# EAGLE design BMCOP (EAGLE 9.6.2)
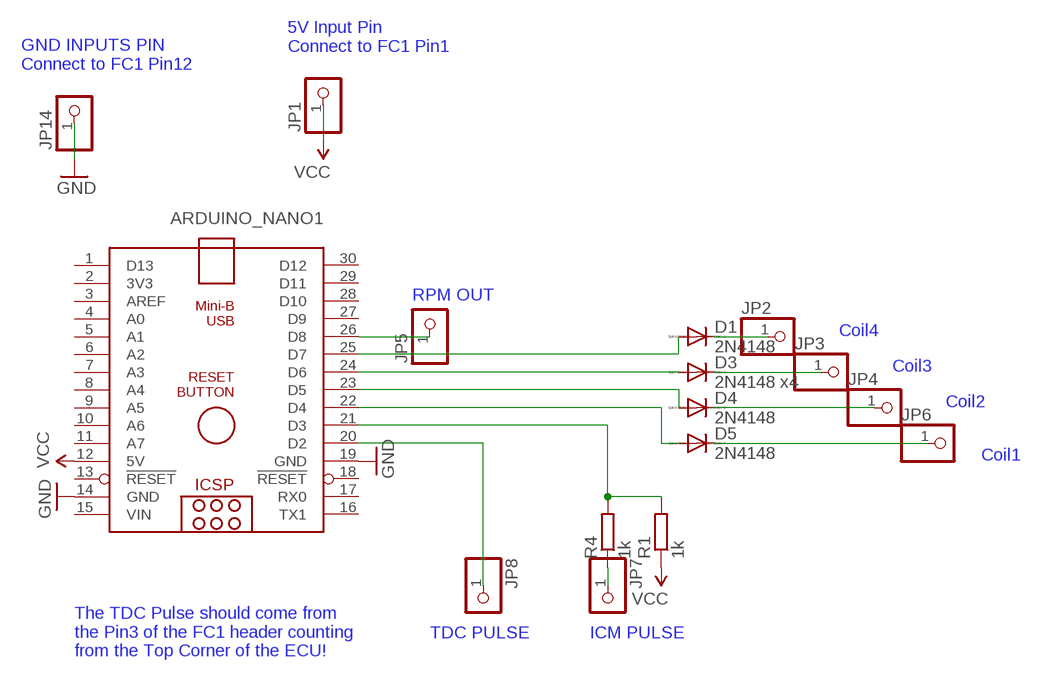
[diagram p0: schematic, sheet 1]

## Parts
ARDUINO_NANO1  ARDUINO_NANO  [ARDUINO_NANO]
D1  2N4148  DIODE-D-7.5  [D-7.5]
D3  2N4148 x4  DIODE-D-7.5  [D-7.5]
D4  2N4148  DIODE-D-7.5  [D-7.5]
D5  2N4148  DIODE-D-7.5  [D-7.5]
JP1  PINHD-1X1  [1X01]
JP2  PINHD-1X1  [1X01]
JP3  PINHD-1X1  [1X01]
JP4  PINHD-1X1  [1X01]
JP5  PINHD-1X1  [1X01]
JP6  PINHD-1X1  [1X01]
JP7  PINHD-1X1  [1X01]
JP8  PINHD-1X1  [1X01]
JP14  PINHD-1X1  [1X01]
R1  1k  R-EU_0204/7  [0204/7]
R4  1k  R-EU_0204/7  [0204/7]

## Nets
GND: ARDUINO_NANO1.14(GND) ARDUINO_NANO1.19(GND) JP14.1
N$1: ARDUINO_NANO1.25(D7) D1.A
N$2: ARDUINO_NANO1.24(D6) D3.A
N$3: ARDUINO_NANO1.23(D5) D4.A
N$4: ARDUINO_NANO1.22(D4) D5.A
N$8: ARDUINO_NANO1.26(D8) JP5.1
N$10: JP7.1 R4.1
N$11: ARDUINO_NANO1.21(D3) R1.2 R4.2
N$21: D4.C JP4.1
N$25: D1.C JP2.1
N$26: D3.C JP3.1
N$29: ARDUINO_NANO1.20(D2) JP8.1
N$31: D5.C JP6.1
VCC: ARDUINO_NANO1.12(5V) JP1.1 R1.1
Unconnected: ARDUINO_NANO1.1(D13) ARDUINO_NANO1.2(3V3) ARDUINO_NANO1.3(AREF) ARDUINO_NANO1.4(A0) ARDUINO_NANO1.5(A1) ARDUINO_NANO1.6(A2) ARDUINO_NANO1.7(A3) ARDUINO_NANO1.8(A4) ARDUINO_NANO1.9(A5) ARDUINO_NANO1.10(A6) ARDUINO_NANO1.11(A7) ARDUINO_NANO1.13(!RESET) ARDUINO_NANO1.16(TX1) ARDUINO_NANO1.17(RX0) ARDUINO_NANO1.18(!RESET) ARDUINO_NANO1.27(D9) ARDUINO_NANO1.28(D10) ARDUINO_NANO1.29(D11) ARDUINO_NANO1.30(D12)

## Notes on the sheet
- 5V Input Pin
  Connect to FC1 Pin1
- GND INPUTS PIN
  Connect to FC1 Pin12
- RPM OUT
- Coil4
- Coil3
- Coil2
- Coil1
- TDC PULSE | ICM PULSE
- The TDC Pulse should come from
  the Pin3 of the FC1 header counting
  from the Top Corner of the ECU!

## Power pins joined to a net without a drawn wire
VIN: ARDUINO_NANO1.15(VIN)

## Library data of the parts
ARDUINO_NANO1 = ArduinoNanoV30:ARDUINO_NANO: Arduino Nano V3.0 Overview: The Arduino Nano is a small, complete, and breadboard-friendly board based on the ATmega328 (Arduino Nano 3.x) or ATmega168 (Arduino Nano 2.x). It has more or less the same functionality of the Arduino Duemilanove, but in a different package. It lacks only a DC power jack, and works with a Mini-B USB cable instead of a standard one. The Nano was designed and is being produced by Gravitech. Specifications: Microcontroller Atmel ATmega168 or ATmega328 Operating Voltage (logic level) 5 V Input Voltage (recommended) 7-12 V Input Voltage (limits) 6-20 V Digital I/O Pins 14 (of which 6 provide PWM output) Analog Input Pins 8 DC Current per I/O Pin 40 mA Flash Memory 16 KB (ATmega168) or 32 KB (ATmega328) of which 2 KB used by bootloader SRAM 1 KB (ATmega168) or 2 KB (ATmega328) EEPROM 512 bytes (ATmega168) or 1 KB (ATmega328) Clock Speed 16 MHz Dimensions 0.73" x 1.70" Length 45 mm Width 18 mm Weigth 5 g Power: The Arduino Nano can be powered via the Mini-B USB connection, 6-20V unregulated external power supply (pin 30), or 5V regulated external power supply (pin 27). The power source is automatically selected to the highest voltage source. Memory: The ATmega168 has 16 KB of flash memory for storing code (of which 2 KB is used for the bootloader); the ATmega328 has 32 KB, (also with 2 KB used for the bootloader). The ATmega168 has 1 KB of SRAM and 512 bytes of EEPROM (which can be read and written with the EEPROM library); the ATmega328 has 2 KB of SRAM and 1 KB of EEPROM. Input and Output: Each of the 14 digital pins on the Nano can be used as an input or output, using pinMode(), digitalWrite(), and digitalRead() functions. They operate at 5 volts. Each pin can provide or receive a maximum of 40 mA and has an internal pull-up resistor (disconnected by default) of 20-50 kOhms. In addition, some pins have specialized functions. Visit Arduino - ArduinoBoardNano <https://www.arduino.cc/en/Main/ArduinoBoardNano>
D1 D3-D5 = diode:DIODE-: DIODE
JP1-JP8 JP14 = pinhead_MOD:PINHD-1X1: PIN HEADER
R1 R4 = resistor:R-EU_: RESISTOR, European symbol

## Net classes
3 usbvcc: width 0.508 mm, drill 0.61 mm, clearance 0.254 mm

## Board
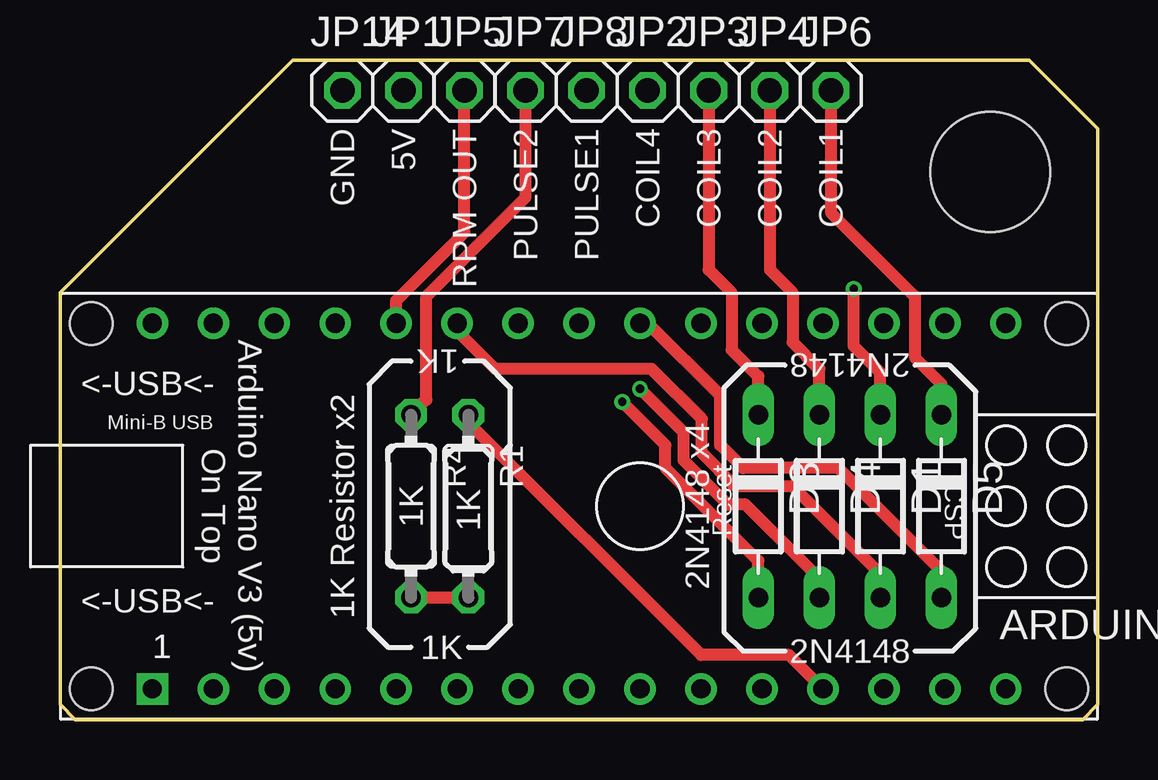
[diagram p1: board, top side]
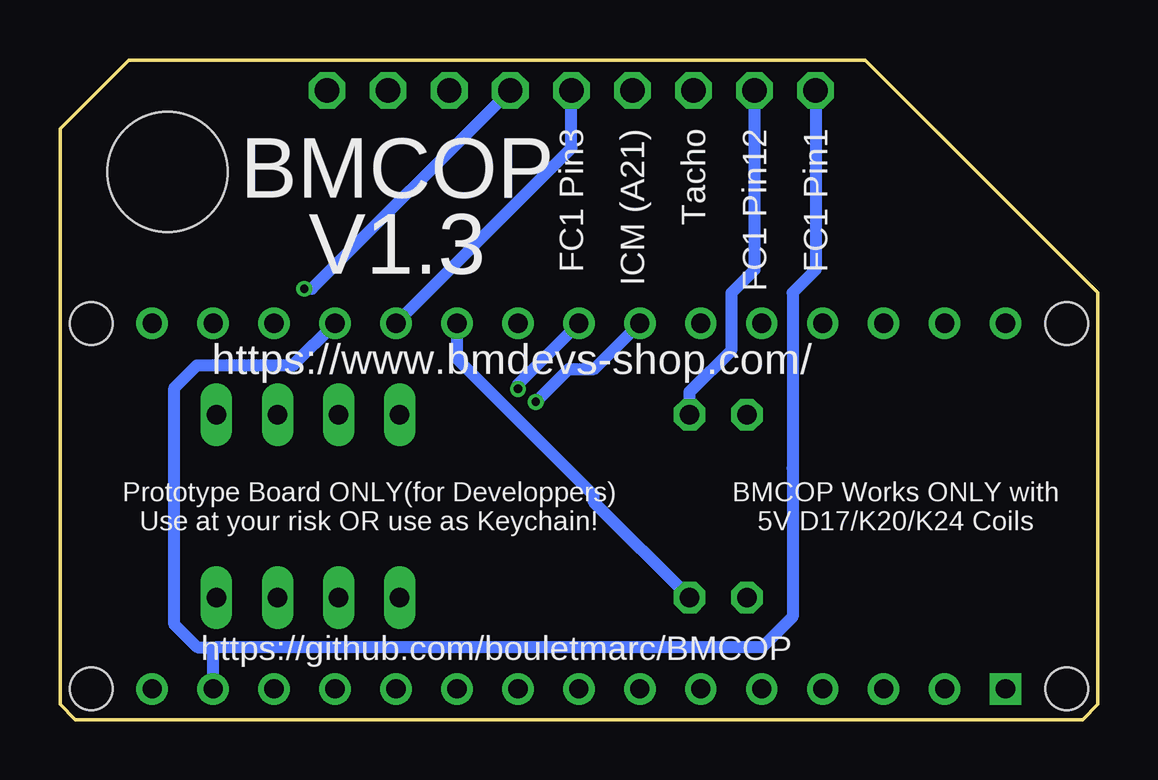
[diagram p2: board, bottom side, seen from below]

Size 43.25 x 27.51 mm. Coordinates in mm from the lower left corner, seen from the top.
Outline: 43.25,0.64 43.25,24.64 40.39,27.51 9.7,27.51 0,17.81 0,0.64 0.64,0 42.61,0 43.25,0.64
Copper layers (1*16): Top 0.035mm / dielectric 1.5mm / Bottom 0.035mm
Design rules "BMBurner_Rules *": minimum track width 10mil, minimum drill 12mil, track to track 10mil, track to pad 10mil, pad to pad 10mil, via to via 10mil, smd to smd 0mil, copper to edge 10mil, drill to drill 10mil, minimum pad ring 10mil, minimum via ring 6mil, stop-mask expansion 2mil, vias tented up to drill 25mil, thermal gap 10mil
Holes 5 mm at 38.76,22.84
tRestrict: area 36.8,20.9 to 40.8,24.9
bRestrict: area 36.8,20.9 to 40.8,24.9

### Footprints (pad centres in the part's own frame; a part is rotated, then mirrored left to right if it is on the bottom)
ARDUINO_NANO = drill 0.8 square: 1 -20.32,-7.62 | drill 0.8: 2 -17.78,-7.62; 3 -15.24,-7.62; 4 -12.7,-7.62; 5 -10.16,-7.62; 6 -7.62,-7.62; 7 -5.08,-7.62; 8 -2.54,-7.62; 9 0,-7.62; 10 2.54,-7.62; 11 5.08,-7.62; 12 7.62,-7.62; 13 10.16,-7.62; 14 12.7,-7.62; 15 15.24,-7.62; 16 15.24,7.62; 17 12.7,7.62; 18 10.16,7.62; 19 7.62,7.62; 20 5.08,7.62; 21 2.54,7.62; 22 0,7.62; 23 -2.54,7.62; 24 -5.08,7.62; 25 -7.62,7.62; 26 -10.16,7.62; 27 -12.7,7.62; 28 -15.24,7.62; 29 -17.78,7.62; 30 -20.32,7.62 | hole 1.778: -22.86,-7.62; -22.86,7.62; 17.78,7.62; 17.78,-7.62
D-7.5 = drill 0.813 long: A 3.81,0; C -3.81,0
1X01 = drill 1.016 octagon: 1 0,0
0204/7 = drill 0.813 octagon: 1 -3.81,0; 2 3.81,0

### Placement (x,y rotation side)
ARDUINO_NANO1  24.17,8.9 0 top
D1  34.19,8.9 270 top
D3  29.1,8.9 270 top
D4  31.64,8.9 270 top
D5  36.73,8.9 270 top
JP1  14.31,26.23 0 top
JP2  24.49,26.23 0 top
JP3  27.03,26.23 0 top
JP4  29.57,26.23 0 top
JP5  16.85,26.23 0 top
JP6  32.12,26.23 0 top
JP7  19.4,26.23 0 top
JP8  21.94,26.23 0 top
JP14  11.77,26.23 0 top
R1  17.01,8.9 270 top
R4  14.63,8.9 270 top

### Tracks (layer width: path | path; a pad name or v marks a point on that pad's centre or on a via)
GND
  Bottom 0.508: JP14.1 11.77,18.76 12.72,17.81 12.72,10.49 12.72,4.29 13.99,3.02 36.73,3.02 | 36.73,3.02 37.52,3.02 38.48,3.98 38.48,13.83 37.52,14.79 33.52,14.79 ARDUINO_NANO1.19 | ARDUINO_NANO1.14 36.87,2.88 36.73,3.02
N$1
  Top 0.508: ARDUINO_NANO1.25 16.55,16.21 18.13,14.63 24.64,14.63 26.75,12.53 26.75,11.13 28.14,9.73 30.53,9.73 34.19,6.08 D1.A
N$2  (via drill 0.35)
  Top 0.508: D3.A 29.1,6.62 25.22,10.5 25.22,11.45 v23.43,13.25
  Bottom 0.508: v23.43,13.25 22.05,14.63 20.98,14.63 ARDUINO_NANO1.24
N$3  (via drill 0.35)
  Top 0.508: D4.A 31.64,5.88 28.55,8.97 27.83,8.97 25.98,10.82 25.98,11.98 v24.17,13.79
  Bottom 0.508: v24.17,13.79 24.17,13.98 ARDUINO_NANO1.23
N$4
  Top 0.508: ARDUINO_NANO1.22 24.5,16.52 27.51,13.52 27.51,11.45 28.46,10.49 32.44,10.49 36.73,6.2 D5.A
N$8
  Top 0.508: ARDUINO_NANO1.26 14.01,17.47 16.85,20.32 JP5.1
N$10
  Top 0.508: R4.1 15.26,13.35 15.26,17.65 19.4,21.78 JP7.1
N$11
  Top 0.508: R4.2 R1.2
  Bottom 0.508: ARDUINO_NANO1.21 26.71,15.06 21.02,9.38 21.02,9.1 R1.2
N$21
  Top 0.508: D4.C 31.64,14.63 30.53,15.74 30.53,17.81 29.57,18.76 JP4.1
N$25  (via drill 0.35)
  Top 0.508: D1.C 34.19,14.47 33.07,15.58 v33.07,17.97
  Bottom 0.508: v33.07,17.97 32.75,17.97 JP2.1
N$26
  Top 0.508: D3.C 29.1,14.31 27.98,15.42 27.98,17.81 27.03,18.76 JP3.1
N$29
  Bottom 0.508: ARDUINO_NANO1.20 21.94,23.83 JP8.1
N$31
  Top 0.508: D5.C 36.73,13.99 35.62,15.11 35.62,17.65 32.12,21.15 JP6.1
VCC
  Top 0.508: ARDUINO_NANO1.12 30.37,2.7 26.71,2.7 17.01,12.4 R1.1
  Bottom 0.508: R1.1 17.01,13.67 15.26,15.42 15.26,17.81 14.31,18.76 JP1.1

### Text on the board
_tsilk: GND | 5V | RPM OUT | PULSE2 | PULSE1 | COIL4 | COIL3 | COIL2 | COIL1 | 1K | 2N4148 | <-USB<- | Arduino Nano V3 (5v) / On Top | 1K Resistor x2 | 1K | 1K | 2N4148 x4 | <-USB<- | 1K | 2N4148
_bsilk: FC1 Pin1 | FC1 Pin12 | Tacho | ICM (A21) | FC1 Pin3 | BMCOP | V1.3 | https://www.bmdevs-shop.com/ | BMCOP Works ONLY with / 5V D17/K20/K24 Coils | Prototype Board ONLY(for Developpers) / Use at your risk OR use as Keychain! | https://github.com/bouletmarc/BMCOP